# EAGLE design Shield (EAGLE 7.5.0)
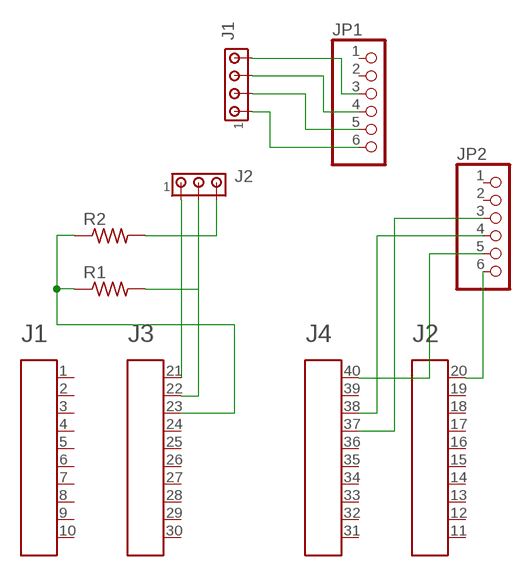
[diagram p0: schematic, sheet 1]

## Parts
A1  HEADER4X10-BOOSTERPACK  [4X10-BOOSTERPACK]
J1  MTA04-156  [1X4MTA]
J2  MTA03-156  [1X3MTA]
JP1  PINHD-1X6  [1X06]
JP2  PINHD-1X6  [1X06]
R1  R-US_0207/10  [0207/10]
R2  R-US_0207/10  [0207/10]

## Nets
N$1: A1.20 JP2.6
N$2: A1.40 JP2.5
N$3: A1.37 JP2.3
N$4: A1.38 JP2.4
N$5: A1.21 J2.1
N$6: J1.1 JP1.6
N$7: J1.2 JP1.5
N$8: J1.3 JP1.4
N$9: J1.4 JP1.3
N$11: J2.3 R2.2
N$12: A1.22 J2.2 R1.2
N$13: A1.23 R1.1 R2.1
Unconnected: A1.1 A1.2 A1.3 A1.4 A1.5 A1.6 A1.7 A1.8 A1.9 A1.10 A1.11 A1.12 A1.13 A1.14 A1.15 A1.16 A1.17 A1.18 A1.19 A1.24 A1.25 A1.26 A1.27 A1.28 A1.29 A1.30 A1.31 A1.32 A1.33 A1.34 A1.35 A1.36 A1.39 JP1.1 JP1.2 JP2.1 JP2.2

## Library data of the parts
A1 = EAGLE_BoosterPack_Library:HEADER4X10-BOOSTERPACK
J1 = con-amp:MTA04-156: AMP connector
J2 = con-amp:MTA03-156: AMP connector
JP1 JP2 = pinhead:PINHD-1X6: PIN HEADER
R1 R2 = resistor:R-US_: RESISTOR, American symbol

## Board
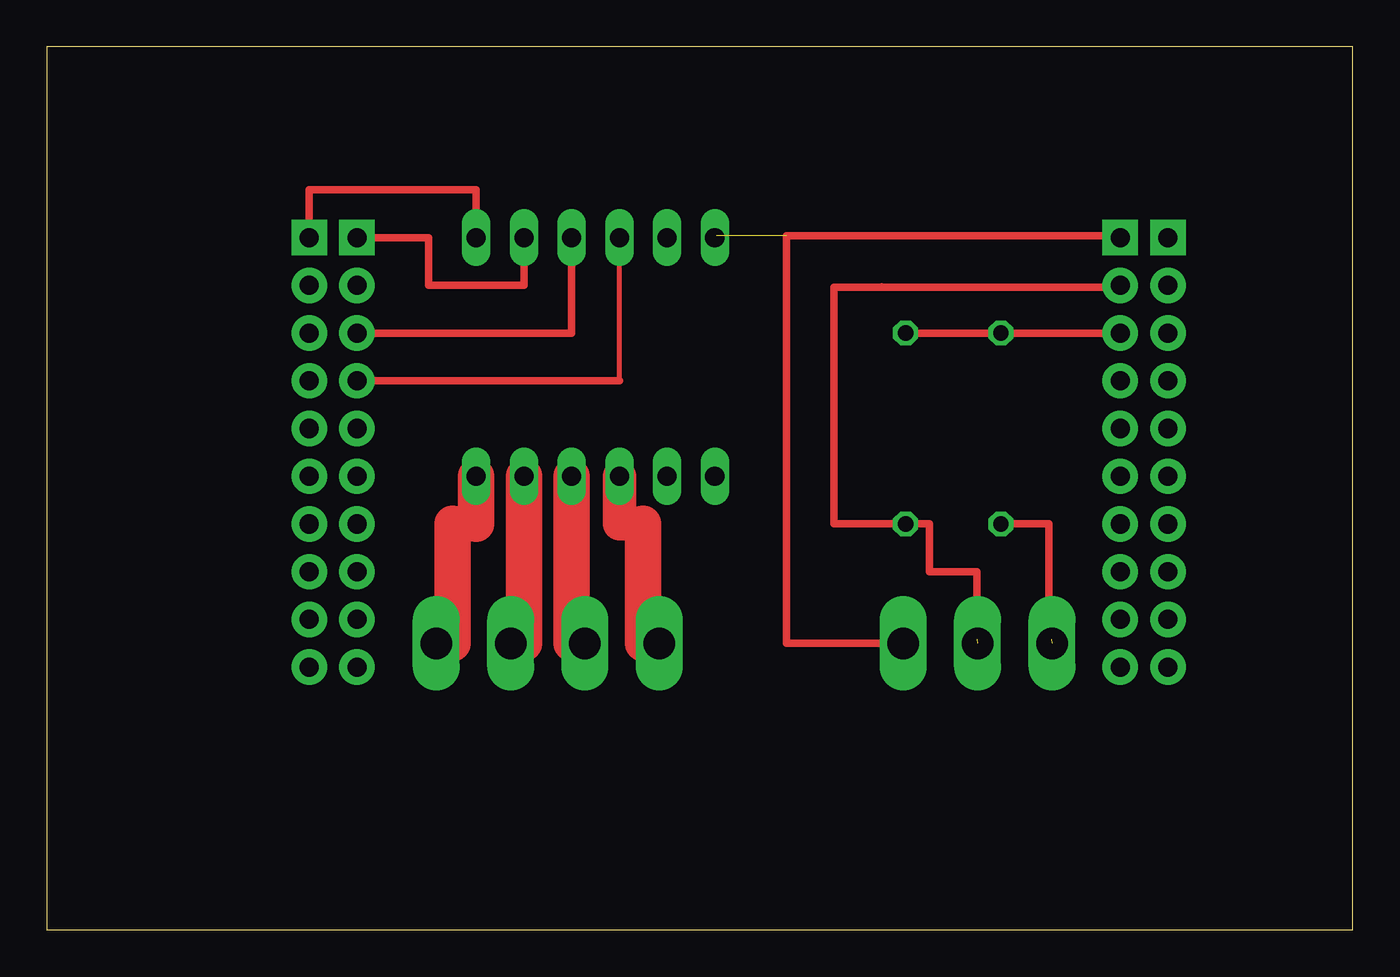
[diagram p1: board, top side]
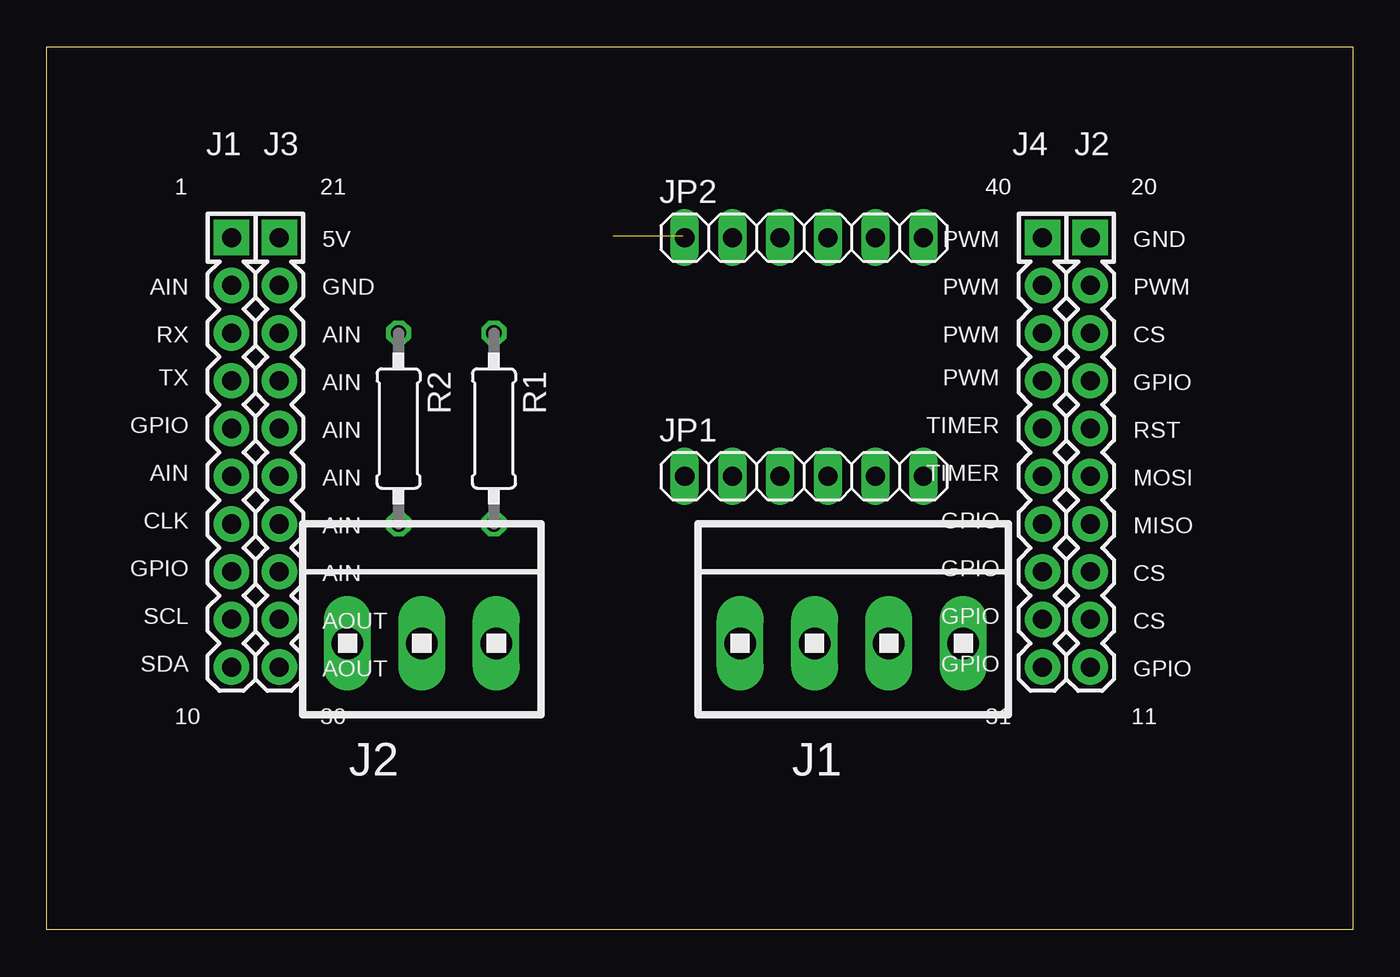
[diagram p2: board, bottom side, seen from below]

Size 69.52 x 46.98 mm. Coordinates in mm from the lower left corner, seen from the top.
Outline: 0,0 69.52,0 69.52,46.98 0,46.98 0,0
Copper layers (1*16): Top 0.035mm / dielectric 1.5mm / Bottom 0.035mm
Design rules "default": minimum track width 10mil, minimum drill 24mil, track to track 8mil, track to pad 8mil, pad to pad 8mil, via to via 8mil, smd to smd 8mil, copper to edge 40mil, drill to drill 8mil, minimum pad ring 10mil, minimum via ring 8mil, stop-mask expansion 4mil, vias tented up to drill 0mil, thermal gap 10mil

### Footprints (pad centres in the part's own frame; a part is rotated, then mirrored left to right if it is on the bottom)
4X10-BOOSTERPACK = drill 1.016 pad 1.88 square: 1 0,10.16; 20 45.72,10.16; 21 2.54,10.16; 40 43.18,10.16 | drill 1.016 pad 1.88: 2 0,7.62; 3 0,5.08; 4 0,2.54; 5 0,0; 6 0,-2.54; 7 0,-5.08; 8 0,-7.62; 9 0,-10.16; 10 0,-12.7; 11 45.72,-12.7; 12 45.72,-10.16; 13 45.72,-7.62; 14 45.72,-5.08; 15 45.72,-2.54; 16 45.72,0; 17 45.72,2.54; 18 45.72,5.08; 19 45.72,7.62; 22 2.54,7.62; 23 2.54,5.08; 24 2.54,2.54; 25 2.54,0; 26 2.54,-2.54; 27 2.54,-5.08; 28 2.54,-7.62; 29 2.54,-10.16; 30 2.54,-12.7; 31 43.18,-12.7; 32 43.18,-10.16; 33 43.18,-7.62; 34 43.18,-5.08; 35 43.18,-2.54; 36 43.18,0; 37 43.18,2.54; 38 43.18,5.08; 39 43.18,7.62
1X4MTA = drill 1.676 long: 1 5.944,0; 2 1.981,0; 3 -1.981,0; 4 -5.944,0
1X3MTA = drill 1.676 long: 1 3.937,0; 2 -0.025,0; 3 -3.988,0
1X06 = drill 1.016 long: 1 -6.35,0; 2 -3.81,0; 3 -1.27,0; 4 1.27,0; 5 3.81,0; 6 6.35,0
0207/10 = drill 0.813 octagon: 1 -5.08,0; 2 5.08,0

### Placement (x,y rotation side)
A1  59.69,26.67 0 bottom
J1  26.67,15.24 0 bottom
J2  49.53,15.24 0 bottom
JP1  29.21,24.13 0 bottom
JP2  29.21,36.83 0 bottom
R1  45.72,26.67 270 bottom
R2  50.8,26.67 270 bottom

### Tracks (layer width: path | path; a pad name or v marks a point on that pad's centre or on a via)
N$1
  Top 0.406: A1.20 13.97,39.37 22.86,39.37 JP2.6
N$2
  Top 0.406: A1.40 20.32,36.83 20.32,34.29 25.4,34.29 JP2.5
N$3
  Top 0.254: 30.48,29.21 JP2.3
  Top 0.406: 30.48,29.21 A1.37
N$4
  Top 0.406: JP2.4 27.94,31.75 A1.38
N$5  (1 unrouted)
  Top 0.254: 57.15,36.93 A1.21
  Top 0.406: 57.15,36.93 39.37,36.93 39.37,15.24 J2.1
N$6
  Top 1.778: J1.1 21.59,15.24 | 21.59,21.59 22.86,21.59
  Top 1.93: 21.59,15.24 21.59,21.59 | 22.86,21.59 JP1.6
N$7
  Top 1.778: J1.2 25.4,15.24
  Top 1.93: 25.4,15.24 JP1.5
N$8
  Top 1.778: J1.3 27.94,15.24
  Top 1.93: 27.94,15.24 JP1.4
N$9
  Top 1.778: J1.4 31.75,15.24 | 31.75,21.59 30.48,21.59 JP1.3
  Top 1.93: 31.75,15.24 31.75,21.59
N$11  (1 unrouted)
  Top 0.406: 53.49,15.44 53.34,15.44 53.34,21.59 R2.2
N$12  (1 unrouted)
  Top 0.254: 57.15,34.19 A1.22 | 41.91,34.19 44.45,34.29
  Top 0.406: 57.15,34.19 41.91,34.19 41.91,21.59 R1.2 46.99,21.59 46.99,19.05 49.53,19.05 49.53,15.44 49.61,15.44
N$13
  Top 0.406: R1.1 R2.1 A1.23